# EAGLE schematic untitled (EAGLE 7.3.0)
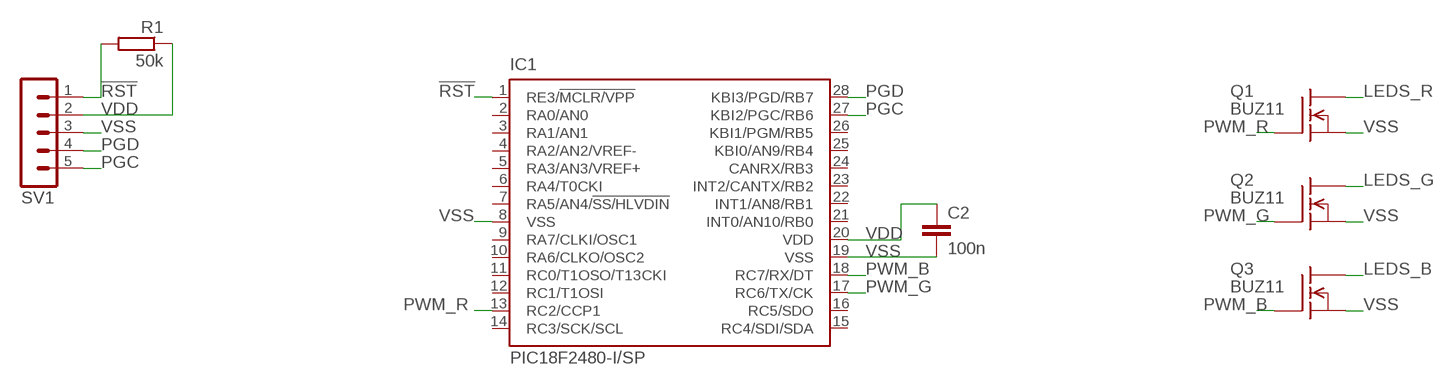
[diagram p0: schematic, sheet 1]

## Parts
C2  100n  C-EU050-024X044  [C050-024X044]
IC1  PIC18F2480-I/SP  [DIL28-3]
Q1  BUZ11  [TO220]
Q2  BUZ11  [TO220]
Q3  BUZ11  [TO220]
R1  50k  R-EU_0207/10  [0207/10]
SV1  MA05-1  [MA05-1]

## Nets
!RST: IC1.1(RE3/!MCLR/VPP) R1.2 SV1.1
LEDS_B: Q3.2(D)
LEDS_G: Q2.2(D)
LEDS_R: Q1.2(D)
PGC: IC1.27(KBI2/PGC/RB6) SV1.5
PGD: IC1.28(KBI3/PGD/RB7) SV1.4
PWM_B: IC1.18(RC7/RX/DT) Q3.1(G)
PWM_G: IC1.17(RC6/TX/CK) Q2.1(G)
PWM_R: IC1.13(RC2/CCP1) Q1.1(G)
VDD: C2.1 IC1.20(VDD) R1.1 SV1.2
VSS: C2.2 IC1.8(VSS) IC1.19(VSS) Q1.3(S) Q2.3(S) Q3.3(S) SV1.3
Unconnected: IC1.2(RA0/AN0) IC1.3(RA1/AN1) IC1.4(RA2/AN2/VREF-) IC1.5(RA3/AN3/VREF+) IC1.6(RA4/T0CKI) IC1.7(RA5/AN4/!SS/HLVDIN) IC1.9(RA7/CLKI/OSC1) IC1.10(RA6/CLKO/OSC2) IC1.11(RC0/T1OSO/T13CKI) IC1.12(RC1/T1OSI) IC1.14(RC3/SCK/SCL) IC1.15(RC4/SDI/SDA) IC1.16(RC5/SDO) IC1.21(INT0/AN10/RB0) IC1.22(INT1/AN8/RB1) IC1.23(INT2/CANTX/RB2) IC1.24(CANRX/RB3) IC1.25(KBI0/AN9/RB4) IC1.26(KBI1/PGM/RB5)

## Library data of the parts
C2 = rcl:C-EU: CAPACITOR, European symbol
IC1 = microchip:PIC18F2*80: 28-Pin Enhanced Flash Microcontrollers with ECAN(TM) Technology 10-Bit A/D and nanoWatt Technology Source: http://www.microchip.com .. 39637a.pdf; MF: MICROCHIP; MPN: PIC18F2480-I/SP; OC_FARNELL: 9321217; OC_NEWARK: 71J7237
Q1-Q3 = transistor-fet:BUZ11: N-Channel Enhancement MOSFET 50V; 30A; 0,040Ohm
R1 = resistor:R-EU_: RESISTOR, European symbol
SV1 = con-lstb:MA05-1: PIN HEADER; OC_FARNELL: unknown; OC_NEWARK: unknown